# Altium schematic sheet RECEPTOR_AIS_FI_R00.SchDoc
size A4; SheetNumber: 4; SheetTotal: 5
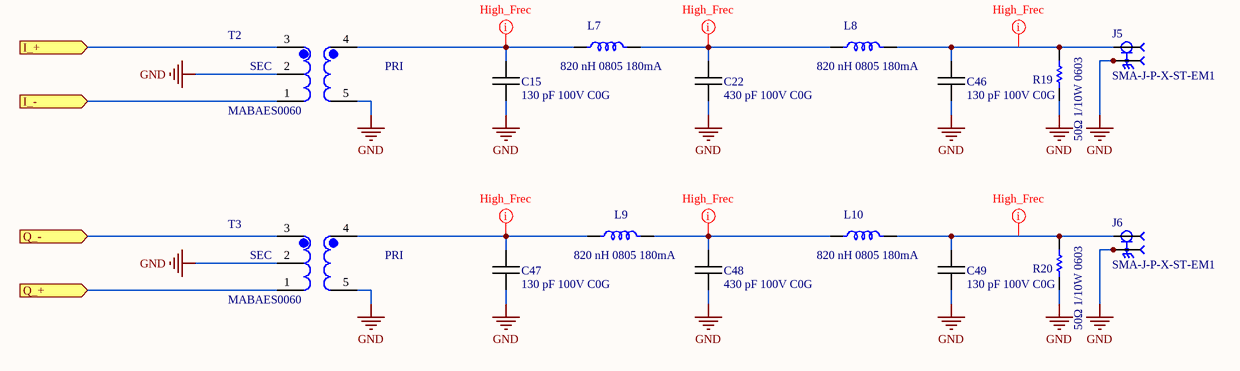
[diagram p0: RECEPTOR_AIS_FI_R00.SchDoc]

## Parts
C15  130 pF 100V C0G  [C_0603]
C22  430 pF 100V C0G  [C_0603]
C46  130 pF 100V C0G  [C_0603]
C47  130 pF 100V C0G  [C_0603]
C48  430 pF 100V C0G  [C_0603]
C49  130 pF 100V C0G  [C_0603]
J5  SMA-J-P-X-ST-EM1  [CONN_SMA-J-P-H-ST-EM1_SAI]
J6  SMA-J-P-X-ST-EM1  [CONN_SMA-J-P-H-ST-EM1_SAI]
L7  820 nH 0805 180mA  [L_0805]
L8  820 nH 0805 180mA  [L_0805]
L9  820 nH 0805 180mA  [L_0805]
L10  820 nH 0805 180mA  [L_0805]
R19  50Ω 1/10W 0603  [R_0603]
R20  50Ω 1/10W 0603  [R_0603]
T2  MABAES0060  [MABAES0060_MCM]
T3  MABAES0060  [MABAES0060_MCM]

## Ports
I_+ (in, see RECEPTOR_AIS_BLK_R00[3A], RECEPTOR_AIS_DEMOD_R00[1A]), I_- (in, see RECEPTOR_AIS_BLK_R00[3B], RECEPTOR_AIS_DEMOD_R00[1A]), Q_+ (in, see RECEPTOR_AIS_BLK_R00[3B], RECEPTOR_AIS_DEMOD_R00[1A]), Q_- (in, see RECEPTOR_AIS_BLK_R00[3B], RECEPTOR_AIS_DEMOD_R00[1B])

## Nets
GND: C15.1 C22.1 C46.1 C47.1 C48.1 C49.1 J5.2 J5.3 J6.2 J6.3 R19.1 R20.1 T2.2 T2.5 T3.2 T3.5
I_+: T2.3 ; port I_+
I_-: T2.1 ; port I_-
Q_+: T3.1 ; port Q_+
Q_-: T3.3 ; port Q_-
NetC15_2: C15.2 L7.1 T2.4
NetC22_2: C22.2 L7.2 L8.1
NetC46_2: C46.2 J5.1 L8.2 R19.2
NetC47_2: C47.2 L9.1 T3.4
NetC48_2: C48.2 L9.2 L10.1
NetC49_2: C49.2 J6.1 L10.2 R20.2

## Layout directives
net class RF_50Ohm: NetC15_2, NetC22_2, NetC46_2, NetC47_2, NetC48_2, NetC49_2

## Notes on the sheet
- (in symbol MABAES0060) SEC; PRI

## Library data of the parts
C15 C46 C47 C49 = Capacitor NP: 130 pF ±1% 100V Ceramic Capacitor C0G, NP0 0603 (1608 Metric)
C22 C48 = Capacitor NP: 430 pF ±5% 100V Ceramic Capacitor C0G, NP0 0603 (1608 Metric)
J5 J6 = SMA-J-P-X-ST-EM1: SMA Connector Jack, Female Socket 50 Ohms Board Edge, Cutout; Surface Mount Solder; MF: Samtec; MP: SMA-J-P-H-ST-EM3; SnapEDA_Link: https://www.snapeda.com/parts/SMA-J-P-H-ST-EM3/Samtec+Inc./view-part/?ref=snap; Package: None; Value: *; Check_prices: https://www.snapeda.com/parts/SMA-J-P-H-ST-EM3/Samtec+Inc./view-part/?ref=eda
L7-L10 = IND: FIXED IND 820NH 180MA 2.35 OHM
R19 R20 = Res1: 50 Ohms ±0.1% 0.1W, 1/10W Chip Resistor 0603 (1608 Metric) Thin Film
T2 T3 = MABAES0060: RF Balun 300kHz ~ 200MHz 1:1 6-SMD (5 Leads), Flat Lead; MF: Mini-Circuits; MP: ADT1-6T+; SnapEDA_Link: https://www.snapeda.com/parts/ADT1-6T+/Mini-Circuits/view-part/?ref=snap; Package: SMD-6 Mini-Circuits; Value: *; Check_prices: https://www.snapeda.com/parts/ADT1-6T+/Mini-Circuits/view-part/?ref=eda